# Altium schematic sheet fpgaTop.SchDoc: FPGA Top Level
size A; SheetNumber: 1; SheetTotal: 3; PageSetup: Record=PageOptions|CenterHorizontal=True|CenterVertical=True|PrintScale=0.70|XCorrection=1.00|YCorrection=1.00|PrintKind=1|BorderSize=5000000|LeftOffset=0|BottomOffset=0|Orientation=2|PaperLength=2794|PaperWidth=2159|Scale=100|PaperSource=7|PrintQuality=600|MediaType=1|DitherType=10|PrintScaleMode=1|PaperKind=Letter|PaperIndex=1; DocumentName: Connectors
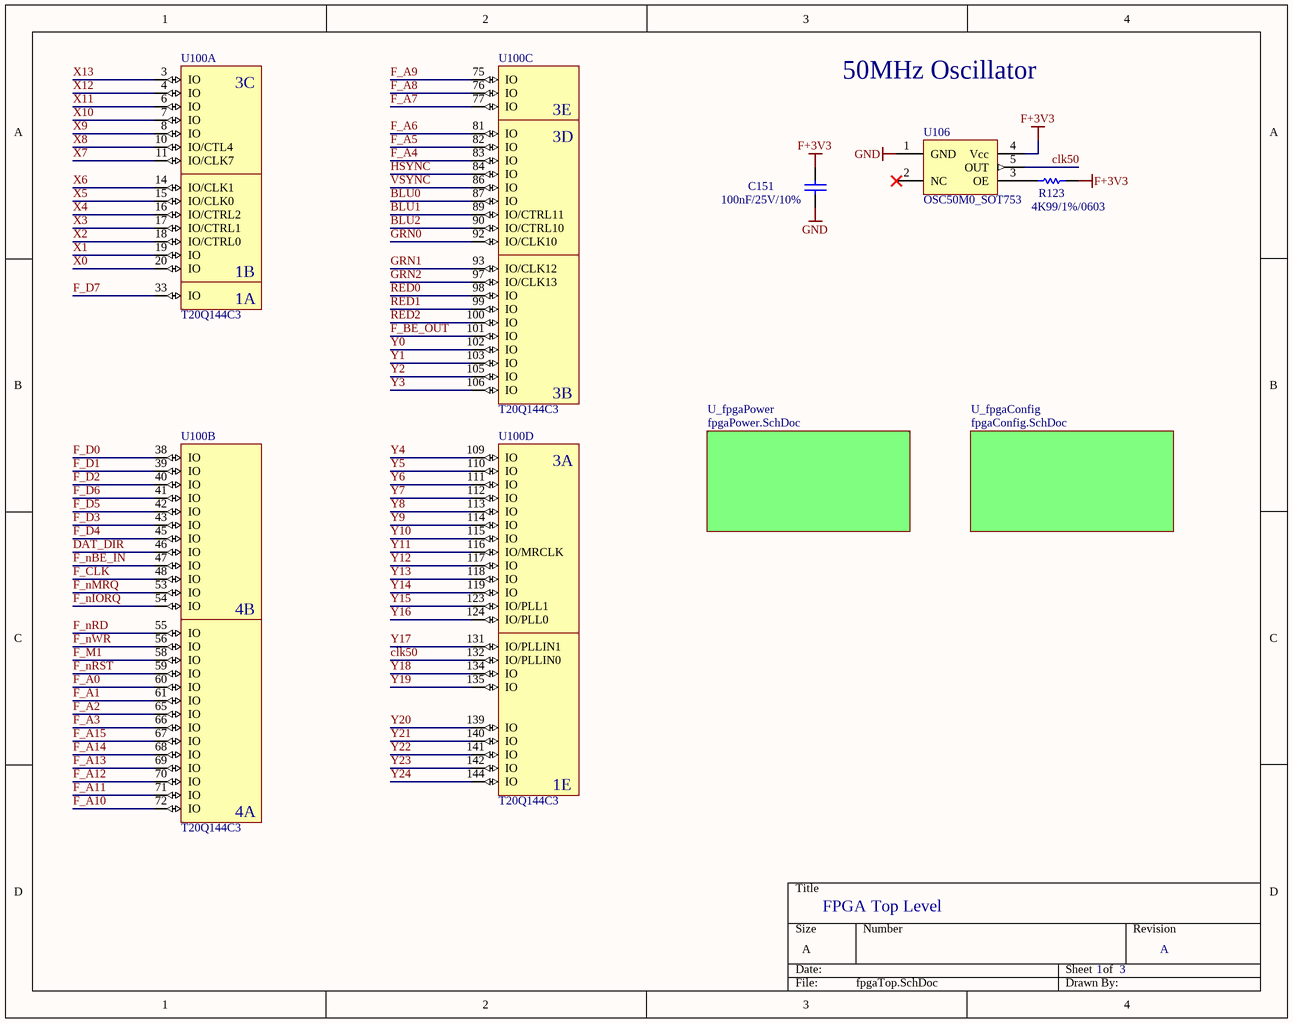
[diagram p0: fpgaTop.SchDoc]

## Parts
C151  100nF/25V/10%  [MY0603]
R123  4K99/1%/0603  [0603]
U100  T20Q144C3  [LQFP144]  (parts A,B,C,D of 6)
U106  OSC50M0_SOT753  [SOT753]

## Sub-sheets
U_fpgaConfig = fpgaConfig.SchDoc: no entries
U_fpgaPower = fpgaPower.SchDoc: no entries

## Nets
F+3V3: C151.2 R123.1 U106.4(Vcc)
GND: C151.1 U106.1(GND)
BLU0: U100.87(IO)
BLU1: U100.89(IO/CTRL11)
BLU2: U100.90(IO/CTRL10)
clk50: U100.132(IO/PLLIN0) U106.5(OUT)
DAT_DIR: U100.46(IO)
F_A0: U100.60(IO)
F_A1: U100.61(IO)
F_A2: U100.65(IO)
F_A3: U100.66(IO)
F_A4: U100.83(IO)
F_A5: U100.82(IO)
F_A6: U100.81(IO)
F_A7: U100.77(IO)
F_A8: U100.76(IO)
F_A9: U100.75(IO)
F_A10: U100.72(IO)
F_A11: U100.71(IO)
F_A12: U100.70(IO)
F_A13: U100.69(IO)
F_A14: U100.68(IO)
F_A15: U100.67(IO)
F_BE_OUT: U100.101(IO)
F_CLK: U100.48(IO)
F_D0: U100.38(IO)
F_D1: U100.39(IO)
F_D2: U100.40(IO)
F_D3: U100.43(IO)
F_D4: U100.45(IO)
F_D5: U100.42(IO)
F_D6: U100.41(IO)
F_D7: U100.33(IO)
F_M1: U100.58(IO)
F_nBE_IN: U100.47(IO)
F_nIORQ: U100.54(IO)
F_nMRQ: U100.53(IO)
F_nRD: U100.55(IO)
F_nRST: U100.59(IO)
F_nWR: U100.56(IO)
GRN0: U100.92(IO/CLK10)
GRN1: U100.93(IO/CLK12)
GRN2: U100.97(IO/CLK13)
HSYNC: U100.84(IO)
RED0: U100.98(IO)
RED1: U100.99(IO)
RED2: U100.100(IO)
VSYNC: U100.86(IO)
X0: U100.20(IO)
X1: U100.19(IO)
X2: U100.18(IO/CTRL0)
X3: U100.17(IO/CTRL1)
X4: U100.16(IO/CTRL2)
X5: U100.15(IO/CLK0)
X6: U100.14(IO/CLK1)
X7: U100.11(IO/CLK7)
X8: U100.10(IO/CTL4)
X9: U100.8(IO)
X10: U100.7(IO)
X11: U100.6(IO)
X12: U100.4(IO)
X13: U100.3(IO)
Y0: U100.102(IO)
Y1: U100.103(IO)
Y2: U100.105(IO)
Y3: U100.106(IO)
Y4: U100.109(IO)
Y5: U100.110(IO)
Y6: U100.111(IO)
Y7: U100.112(IO)
Y8: U100.113(IO)
Y9: U100.114(IO)
Y10: U100.115(IO)
Y11: U100.116(IO/MRCLK)
Y12: U100.117(IO)
Y13: U100.118(IO)
Y14: U100.119(IO)
Y15: U100.123(IO/PLL1)
Y16: U100.124(IO/PLL0)
Y17: U100.131(IO/PLLIN1)
Y18: U100.134(IO)
Y19: U100.135(IO)
Y20: U100.139(IO)
Y21: U100.140(IO)
Y22: U100.141(IO)
Y23: U100.142(IO)
Y24: U100.144(IO)
NetR123_2: R123.2 U106.3(OE)

Not connected (* = marked no-connect by the designer): U106 2(NC)*

## Notes on the sheet
- 50MHz Oscillator
- A
- (in symbol T20Q144C3, part A) 3C; 1B; 1A
- (in symbol T20Q144C3, part B) 4B; 4A
- (in symbol T20Q144C3, part C) 3E; 3D; 3B
- (in symbol T20Q144C3, part D) 3A; 1E

## Library data of the parts
C151 = CAP100NF25V: 0.1µF ±10% 25V Ceramic Capacitor X7R 0603 (1608 Metric); MFG PN: 06033C104KAT2A; DK PN: 478-3714-1-ND; MFG: AVX; FOOTPRINT: 0603; Populate: *
R123 = RES4K99: 4.99k Ohm ±1% 0.1W, 1/10W Chip Resistor 0603 (1608 Metric) Moisture Resistant Thick Film; MFG PN: RC0603FR-074K99L; DK PN: 311-4.99KHRTR-ND; MFG: Yageo; Populate: *; Comment_1: 4K99/1%/0603
U100 = T20Q144C3: Trion® Field Programmable Gate Array (FPGA) IC 97 1044 19728 144-LQFP; MFG: Efinix; DK PN: 2134-T20Q144C3-ND; MFG PN: T20Q144C3; FOOTPRINT: 144QFP; Populate: *
U106 = OSC50M0_SOT753: 50 MHz XO (Standard) HCMOS, LVCMOS Oscillator 2.5V ~ 3.3V Standby (Power Down) SC-74A, SOT-753; MFG PN: SIT2001BI-S3-XXS-50.000000; DK PN: 1473-SIT2001BI-S3-XXS-50.000000-ND; MFG: SiTime; Populate: *